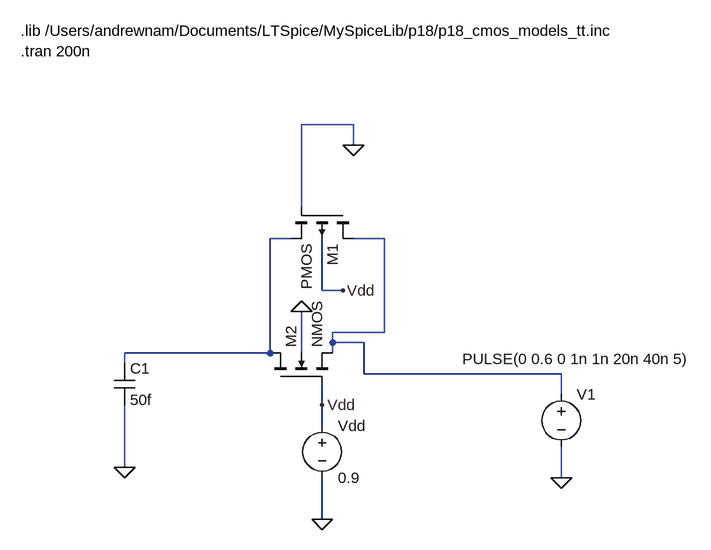
[diagram p0: schematic fig14_transmission_gate.asc]
fig14_transmission_gate.asc, the LTspice schematic file:
Version 4
SHEET 1 1184 704
WIRE 592 80 512 80
WIRE 592 112 592 80
WIRE 512 208 512 80
WIRE 496 256 464 256
WIRE 640 256 592 256
WIRE 544 336 544 256
WIRE 576 336 544 336
WIRE 640 400 640 256
WIRE 640 400 560 400
WIRE 560 416 560 400
WIRE 608 416 560 416
WIRE 464 432 464 256
WIRE 464 432 240 432
WIRE 512 432 512 368
WIRE 560 432 560 416
WIRE 240 448 240 432
WIRE 608 464 608 416
WIRE 912 464 608 464
WIRE 912 496 912 464
WIRE 544 512 544 480
WIRE 544 544 544 512
WIRE 240 608 240 512
WIRE 912 624 912 576
WIRE 544 688 544 624
FLAG 592 112 0
FLAG 912 624 0
FLAG 544 688 0
FLAG 240 608 0
FLAG 512 368 0
FLAG 576 336 Vdd
FLAG 544 512 Vdd
SYMBOL voltage 912 480 R0
WINDOW 3 -152 -39 Left 2
SYMATTR InstName V1
SYMATTR Value PULSE(0 0.6 0 1n 1n 20n 40n 5)
SYMBOL voltage 544 528 R0
SYMATTR InstName Vdd
SYMATTR Value 0.9
SYMBOL pmos4 592 208 R90
SYMATTR InstName M1
SYMATTR Value2 l=0.18u w=30u
SYMBOL nmos4 464 480 R270
SYMATTR InstName M2
SYMATTR Value2 l=0.18u w=10u
SYMBOL cap 224 448 R0
SYMATTR InstName C1
SYMATTR Value 50f
TEXT 80 -64 Left 2 !.lib /Users/andrewnam/Documents/LTSpice/MySpiceLib/p18/p18_cmos_models_tt.inc\n.tran 200n

The netlist it stands for:
* fig14_transmission_gate.asc
V1 N002 0 PULSE(0 0.6 0 1n 1n 20n 40n 5)
Vdd Vdd 0 0.9
M1 N002 0 N001 Vdd PMOS l=0.18u w=30u
M2 N001 Vdd N002 0 NMOS l=0.18u w=10u
C1 N001 0 50f
.model NMOS NMOS
.model PMOS PMOS
.lib standard.mos
.lib /Users/andrewnam/Documents/LTSpice/MySpiceLib/p18/p18_cmos_models_tt.inc
.tran 200n
.backanno
.end